# EAGLE schematic led (EAGLE 9.7.0)
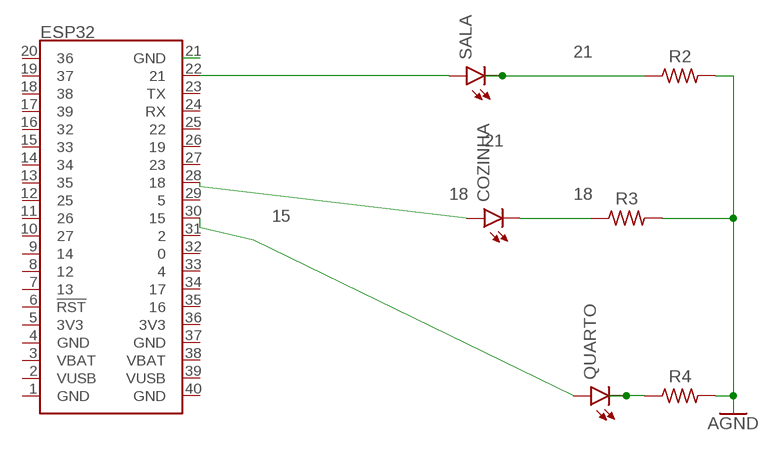
[diagram p0: schematic, sheet 1]

## Parts
COZINHA  LED_RADIALYELLOW  [LEDRD254W60D565H860B_Y]
ESP32  ESP32_THING_WO_ANT_KEEPOUT  [ESP32_THING_NO_ANT]
QUARTO  LED_RADIALYELLOW  [LEDRD254W60D565H860B_Y]
R2  R-US_AXIAL-7.2MM-PITCH  [RESAD724W46L381D178B]
R3  R-US_AXIAL-7.2MM-PITCH  [RESAD724W46L381D178B]
R4  R-US_AXIAL-7.2MM-PITCH  [RESAD724W46L381D178B]
SALA  LED_RADIALYELLOW  [LEDRD254W60D565H860B_Y]

## Nets
15: ESP32.30 QUARTO.A
18: COZINHA.A COZINHA.C ESP32.28 R3.1
21: ESP32.22 R2.1 SALA.A SALA.C
AGND: R2.2 R3.2 R4.2
N$1: ESP32.21(GND)
N$9: QUARTO.C R4.1
Unconnected: ESP32.1(GND) ESP32.2(VUSB) ESP32.3(VBAT) ESP32.4(GND) ESP32.5(3V3) ESP32.6(!RST!) ESP32.7 ESP32.8 ESP32.9 ESP32.10 ESP32.11 ESP32.12 ESP32.13 ESP32.14 ESP32.15 ESP32.16 ESP32.17 ESP32.18 ESP32.19 ESP32.20 ESP32.23(TX) ESP32.24(RX) ESP32.25 ESP32.26 ESP32.27 ESP32.29 ESP32.31 ESP32.32 ESP32.33 ESP32.34 ESP32.35 ESP32.36(3V3) ESP32.37(GND) ESP32.38(VBAT) ESP32.39(VUSB) ESP32.40(GND)

## Library data of the parts
COZINHA QUARTO SALA = Opto-Electronic:LED_RADIAL: LED - Generic
ESP32 = SparkFun-Boards:ESP32_THING: SparkFun ESP32 Thing Board Pins, silkscreen, and logos matching the layout of the SparkFun ESP32 Thing <https://www.sparkfun.com/products/13907> Dimensions: 2.32" x 1.00"
R2-R4 = Resistor:R-US: Resistor Fixed - ANSI; CATEGORY: Resistor; SUB-CATEGORY: Fixed